# EAGLE design HeatController (EAGLE 9.6.2)
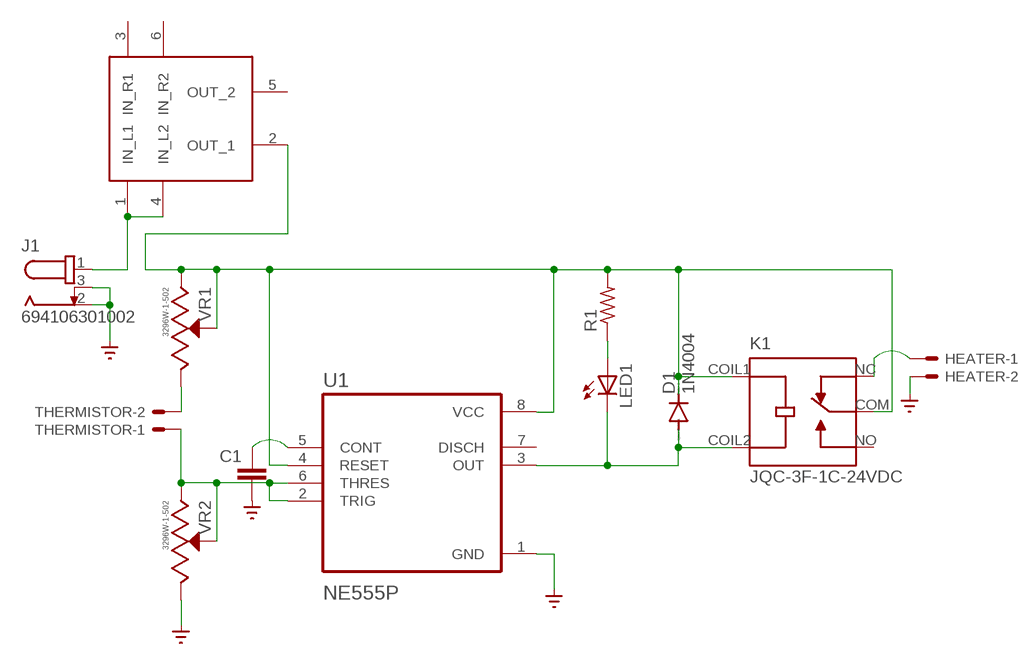
[diagram p0: schematic, sheet 1]

## Parts
C1  C-EUC0603  [C0603]
D1  1N4004  [DO41-10]
HEATER  JST-XH-02-PIN-LONG-PAD  [JST-XH-02-PACKAGE-LONG-PAD]
J1  694106301002  [694106301002]
K1  JQC-3F-1C-24VDC  [RELAY_JQC-3F-1C-24VDC]
LED1  LED5MM  [LED5MM]
R1  R-US_0204/7  [0204/7]
THERMISTOR  JST-XH-02-PIN-LONG-PAD  [JST-XH-02-PACKAGE-LONG-PAD]
U1  NE555P  [DIP794W45P254L959H508Q8]
U$1  54-307PC  [54-307PC]
VR1  3296W-1-502  [TRIM_3296W-1-502]
VR2  3296W-1-502  [TRIM_3296W-1-502]

## Nets
GND: C1.1 HEATER.2 J1.2 J1.3 U1.1(GND) VR2.3(CW) ; supply symbol labelled SUPPLY0_GND_
N$1: THERMISTOR.1 U1.2(TRIG) U1.6(THRES) VR2.1(CCW) VR2.2(WIPER)
N$2: J1.1 U$1.1(IN_L1) U$1.4(IN_L2)
N$3: HEATER.1 K1.NC
N$4: C1.2 U1.5(CONT)
N$5: D1.C K1.COIL1 K1.COM R1.2 U1.4(RESET) U1.8(VCC) U$1.2(OUT_1) VR1.1(CCW) VR1.2(WIPER)
N$6: THERMISTOR.2 VR1.3(CW)
N$7: D1.A K1.COIL2 LED1.K(C) U1.3(OUT)
N$8: LED1.A R1.1
Unconnected: K1.NO U1.7(DISCH) U$1.3(IN_R1) U$1.5(OUT_2) U$1.6(IN_R2)

## Library data of the parts
C1 = rcl:C-EU: CAPACITOR, European symbol; SPICEPREFIX: C
D1 = diode:1N4004: DIODE general purpose rectifier, 1 A
HEATER THERMISTOR = Rembrandt Electronics - JST XH Connectors v1-0:JST-XH-02-PIN: JST XH Connector 2 Pin Wire to board connector. Pitch: 2,54 mm, (0.100") Number of pins: 2 Created by Rembrandt Electronics www.rembrandtelectronics.com
J1 = DC Power Jacks:694106301002: CONN PWR JACK 2.1X5.5MM SOLDER Manufacturer's datasheet <https://katalog.we-online.de/em/datasheet/6941xx301002.pdf>; CREATED_BY: PCBLayout.com; DIGIKEY_PART_NUMBER: 732-5930-ND; MANUFACTURER: Wurth Electronics Inc.; MPN: 694106301002
K1 = JQC-3F-1C-24VDC:JQC-3F-1C-24VDC: Miniature PCB Relay 24VDC, 10A 250VAC, 15A 125VAC, 10A 250VAC Check prices <https://pricing.snapeda.com/parts/JQC-3F-1C-24VDC/YUEQING%20HENGWEI%20ELECTRONICS%20CO.%2CLTD./view-part?ref=eda>; AVAILABILITY: Not in stock; DESCRIPTION: Miniature PCB Relay 24VDC, 10A 250VAC, 15A 125VAC, 10A 250VAC; MF: YUEQING HENGWEI ELECTRONICS CO.,LTD.; MP: JQC-3F-1C-24VDC; PACKAGE: None; PRICE: None
LED1 = adafruit:LED: LED OSRAM: - CHIPLED LG R971, LG N971, LY N971, LG Q971, LY Q971, LO R971, LY R971 LH N974, LH R974 LS Q976, LO Q976, LY Q976 LO Q996 - Hyper CHIPLED LW Q18S LB Q993, LB Q99A, LB R99A - SideLED LS A670, LO A670, LY A670, LG A670, LP A670 LB A673, LV A673, LT A673, LW A673 LH A674 LY A675 LS A676, LA A676, LO A676, LY A676, LW A676 LS A679, LY A679, LG A679 - Hyper Micro SIDELED® LS Y876, LA Y876, LO Y876, LY Y876 LT Y87S - SmartLED LW L88C, LW L88S LB L89C, LB L89S, LG L890 LS L89K, LO L89K, LY L89K LS L896, LA L896, LO L896, LY L896 - TOPLED LS T670, LO T670, LY T670, LG T670, LP T670 LSG T670, LSP T670, LSY T670, LOP T670, LYG T670 LG T671, LOG T671, LSG T671 LB T673, LV T673, LT T673, LW T673 LH T674 LS T676, LA T676, LO T676, LY T676, LB T676, LH T676, LSB T676, LW T676 LB T67C, LV T67C, LT T67C, LS T67K, LO T67K, LY T67K, LW E67C LS E67B, LA E67B, LO E67B, LY E67B, LB E67C, LV E67C, LT E67C LW T67C LS T679, LY T679, LG T679 LS T770, LO T770, LY T770, LG T770, LP T770 LB T773, LV T773, LT T773, LW T773 LH T774 LS E675, LA E675, LY E675, LS T675 LS T776, LA T776, LO T776, LY T776, LB T776 LHGB T686 LT T68C, LB T68C - Hyper Mini TOPLED® LB M676 - Mini TOPLED Santana® LG M470 LS M47K, LO M47K, LY M47K Source: http://www.osram.convergy.de/
R1 = rcl:R-US_: RESISTOR, American symbol; SPICEPREFIX: R
U1 = NE555P:NE555P: Check prices <https://pricing.snapeda.com/parts/NE555P/Texas%20Instruments/view-part?ref=eda>; AVAILABILITY: In Stock; DESCRIPTION: Single Precision Timer 8-PDIP 0 to 70; MF: Texas Instruments; MP: NE555P; PACKAGE: PDIP-8 Texas; PRICE: None; PURCHASE-URL: https://pricing.snapeda.com/search/part/NE555P/?ref=eda
U$1 = 54-307PC:54-307PC
VR1 VR2 = 3296W-1-502:3296W-1-502: Res Cermet Trimmer 500K Ohm 10% 0.5W 25(Elec)Turn 2.19mm (9.53 X 4.83 X 11.55mm) Pin Thru-Hole Tube; DESCRIPTION: 5 kOhms 0.5W, 1/2W PC Pins Through Hole Trimmer Potentiometer Cermet 25 Turn Top Adjustment; DIGI-KEY_PART_NUMBER: 3296W-1-502RLFTR-ND; MF: Bourns; MP: 3296W-1-502; PACKAGE: SOT-23-5 Bourns

## Board
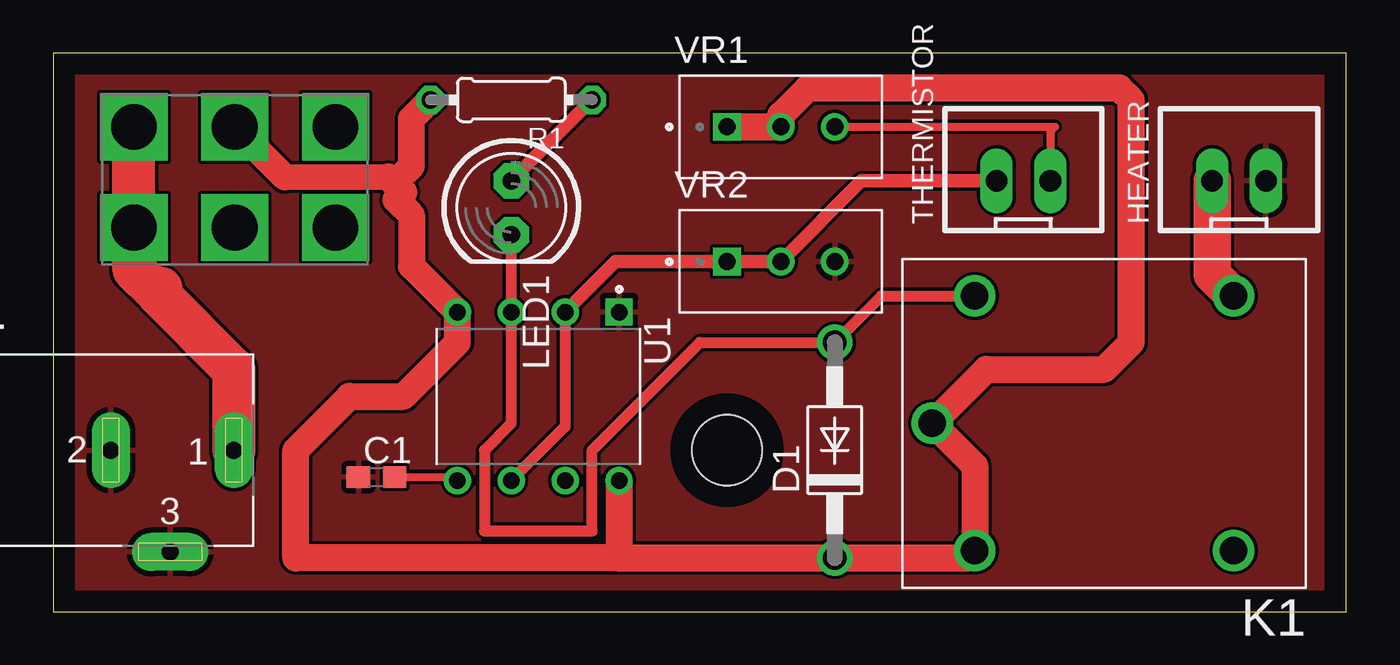
[diagram p1: board, top side]
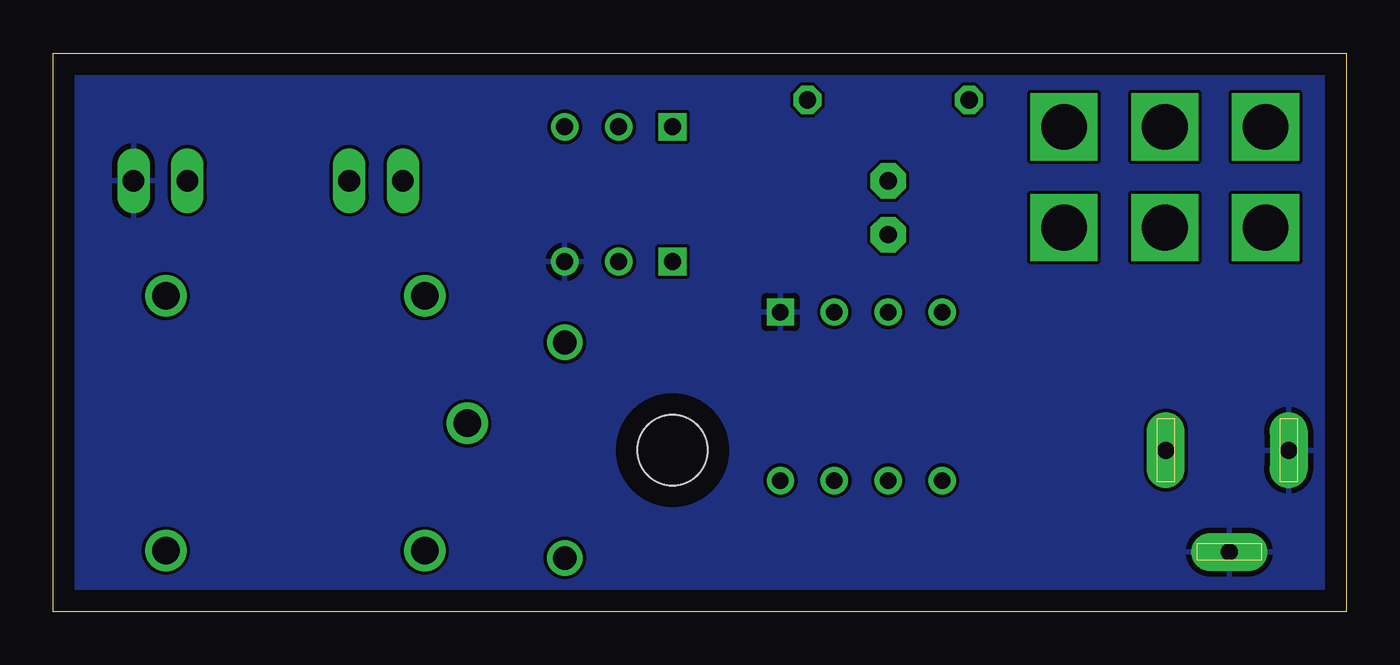
[diagram p2: board, bottom side, seen from below]

Size 60.94 x 26.34 mm. Coordinates in mm from the lower left corner, seen from the top.
Outline: 0,0 60.94,0 60.94,26.34 0,26.34 0,0
Copper layers (1*16): Top 0.035mm / dielectric 1.5mm / Bottom 0.035mm
Design rules "default": minimum track width 6mil, minimum drill 0.35mm, track to track 6mil, track to pad 6mil, pad to pad 6mil, via to via 6mil, smd to smd 6mil, copper to edge 40mil, drill to drill 6mil, minimum pad ring 10mil, minimum via ring 8mil, stop-mask expansion 4mil, vias tented up to drill 0mil, thermal gap 10mil
Holes 3.3 mm at 31.75,7.62

### Footprints (pad centres in the part's own frame; a part is rotated, then mirrored left to right if it is on the bottom)
C0603 = smd 1.1 x 1: 1 -0.85,0; 2 0.85,0
DO41-10 = drill 1.118: A 5.08,0; C -5.08,0
JST-XH-02-PACKAGE-LONG-PAD = drill 1.016 long: 1 -1.27,0; 2 1.27,0
694106301002 = drill 0.8 pad 1.8 long: 1 13.6,0; 2 7.8,0; 3 10.6,-4.8
RELAY_JQC-3F-1C-24VDC = drill 1.3: COIL1 6.1,6; COIL2 6.1,-6; COM 8.1,0; NC -6.1,-6; NO -6.1,6
LED5MM = drill 0.813 pad 1.676 octagon: A -1.27,0; K 1.27,0
0204/7 = drill 0.813 octagon: 1 -3.81,0; 2 3.81,0
DIP794W45P254L959H508Q8 = drill 0.78 pad 1.13 square: 1 -3.97,3.81 | drill 0.78 pad 1.13: 2 -3.97,1.27; 3 -3.97,-1.27; 4 -3.97,-3.81; 5 3.97,-3.81; 6 3.97,-1.27; 7 3.97,1.27; 8 3.97,3.81
54-307PC = drill 2.15 square: 1 0,0; 2 4.75,0; 3 9.5,0; 4 0,-4.75; 5 4.75,-4.75; 6 9.5,-4.75
TRIM_3296W-1-502 = drill 0.8 square: 1 -2.54,0 | drill 0.8: 2 0,0; 3 2.54,0

### Placement (x,y rotation side)
C1  15.24,6.35 0 top
D1  36.83,7.62 90 top
HEATER  55.88,20.32 0 top
J1  -5.08,7.62 0 top
K1  49.53,8.89 180 top
LED1  21.59,19.05 270 top
R1  21.59,24.13 180 top
THERMISTOR  45.72,20.32 0 top
U1  22.86,10.16 270 top
U$1  3.81,22.86 0 top
VR1  34.29,22.86 0 top
VR2  34.29,16.51 0 top

### Tracks (layer width: path | path; a pad name or v marks a point on that pad's centre or on a via)
GND
  pour Top: 0,26.67 60.96,26.67 60.96,0 0,0
  pour Bottom: 0,26.67 60.96,26.67 60.96,0 0,0
N$1
  Top 0.508: U1.2 24.13,8.73 U1.6
  Top 0.635: U1.2 26.51,16.51 VR2.1 VR2.2 38.1,20.32 THERMISTOR.1
N$2
  Top 2.032: 5.08,15.24 4.89,15.05 | 4.89,15.05 8.52,11.43 J1.1 | 4.89,15.05 3.81,16.14 U$1.4 U$1.1
N$3
  Top 1.778: K1.NC 54.61,15.91 HEATER.1
N$4
  Top 0.381: C1.2 18.89,6.35 U1.5
N$5
  Top 1.194: 15.79,20.5 10.92,20.5
  Top 1.27: 26.67,2.54 D1.C 43.08,2.54 K1.COIL1 43.43,6.89 K1.COM 43.97,11.43 49.53,11.43 50.8,12.7 50.8,24.13 50.24,24.69 35.56,24.69 34.29,23.42 VR1.2 VR1.1 | U1.8 26.67,2.54 | 26.67,2.54 11.43,2.54 11.43,7.62 13.97,10.16 16.51,10.16 19.05,12.7 U1.4 16.89,16.29 16.89,18.69 16.16,19.42 16.52,19.77 16.09,20.21 | U$1.2 10.92,20.5 | 16.09,20.21 16.89,21.01 16.89,23.24 R1.2 | 15.79,20.5 16.09,20.21
N$6
  Top 0.381: THERMISTOR.2 46.99,22.64 47.2,22.86 VR1.3
N$7
  Top 0.508: LED1.K U1.3 21.59,8.89 20.32,7.62 20.32,3.81 25.4,3.81 25.4,7.62 30.48,12.7 D1.A 39.02,14.89 K1.COIL2
N$8
  Top 0.635: LED1.A R1.1